# Altium schematic sheet Motor.SchDoc
size A3
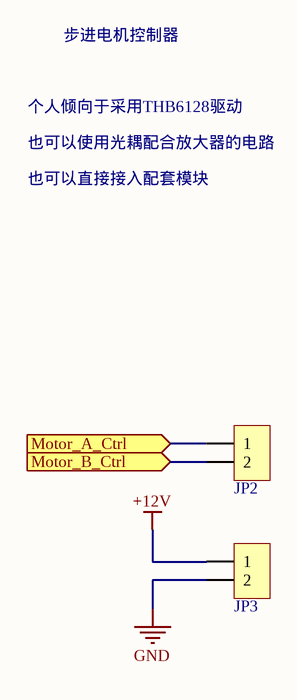
[diagram p0: Motor.SchDoc]

## Parts
JP2  HDR-1X2  [KF350-2P]  (value not drawn)
JP3  HDR-1X2  [KF128-3.81-2P]  (value not drawn)

## Ports
Motor_A_Ctrl (in), Motor_B_Ctrl (in)

## Nets
+12V: JP3.1
GND: JP3.2
Motor_A_Ctrl: JP2.1 ; port Motor_A_Ctrl
Motor_B_Ctrl: JP2.2 ; port Motor_B_Ctrl

## Notes on the sheet
- 步进电机控制器
- 个人倾向于采用THB6128驱动
- 也可以使用光耦配合放大器的电路
- 也可以直接接入配套模块

## Library data of the parts
JP2 JP3 = Header 2: 2P接插件; 版权归属: 源创客; BOM名称: 2P接插件; 学习资源: www.ooocke.com